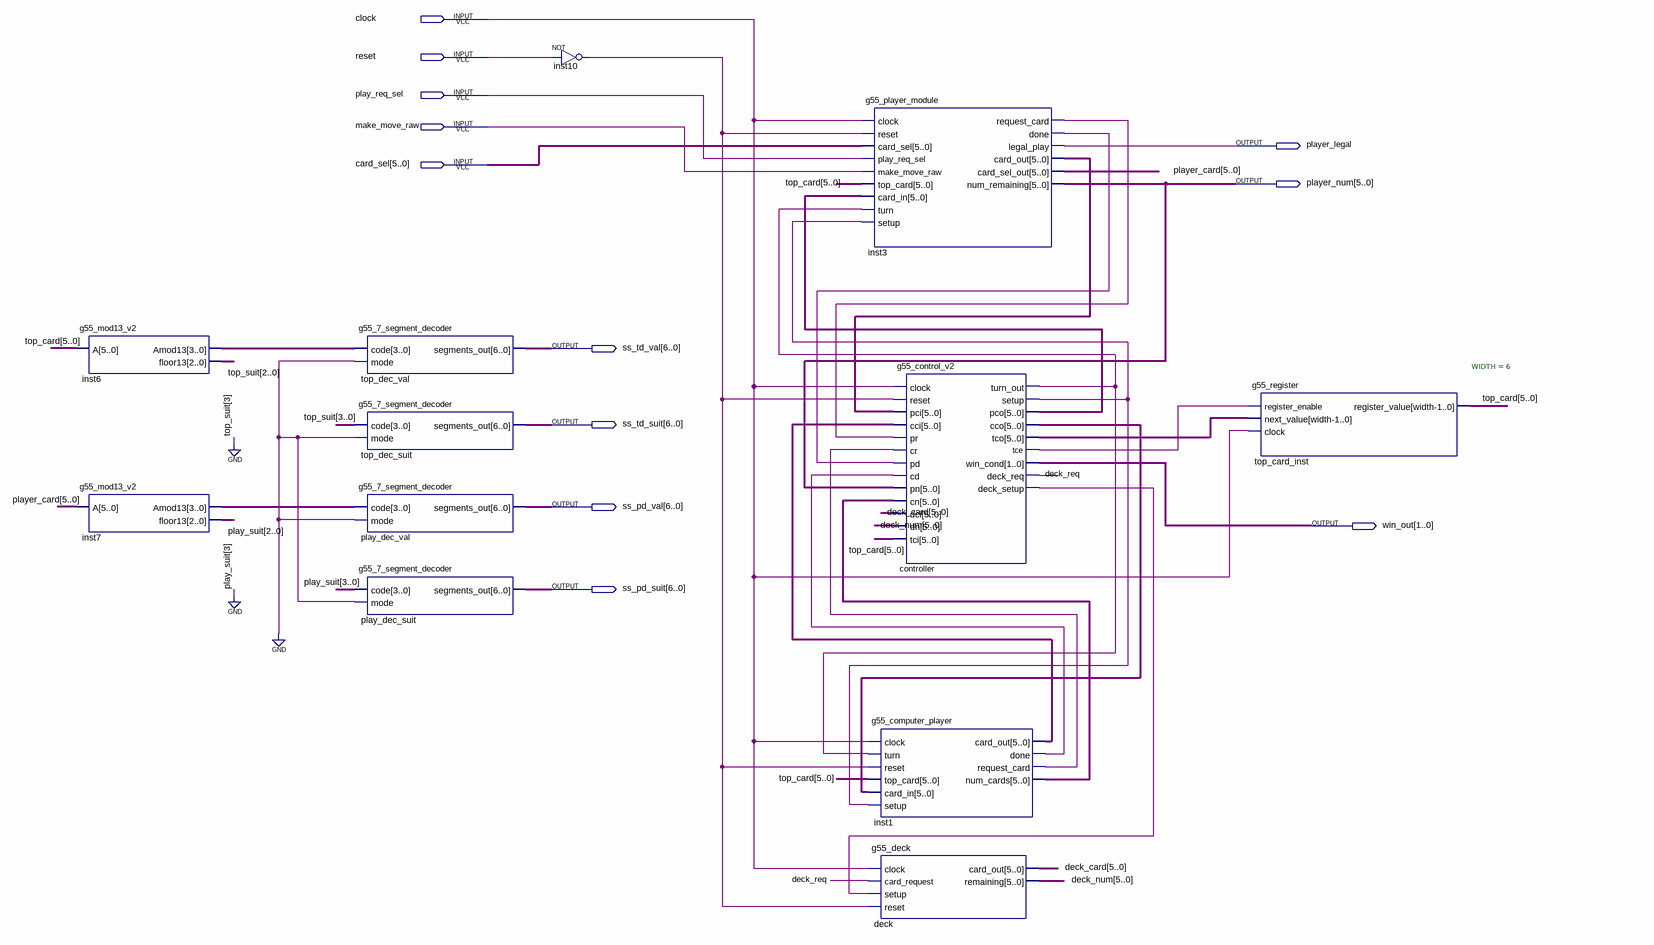
[diagram p0: schematic sheet]
// Quartus schematic g55_system_v2.bdf as structural Verilog: 12 symbols, 12 pins
module g55_system_v2 (
  input  clock,
  input  reset,
  input  play_req_sel,
  input  make_move_raw,
  input  [5:0] card_sel,
  output player_legal,
  output [5:0] player_num,
  output [6:0] ss_td_val,
  output [6:0] ss_td_suit,
  output [6:0] ss_pd_val,
  output [1:0] win_out,
  output [6:0] ss_pd_suit
);

  wire controller_deck_setup, controller_setup, controller_tce, controller_turn_out, deck_req, inst1_done,
       inst1_request_card, inst3_done, inst3_request_card, inst10_out;
  wire [2:0] play_suit, top_suit;
  wire [3:0] inst6_amod13, inst7_amod13;
  wire [5:0] controller_cco, controller_pco, controller_tco, deck_card, deck_num, inst1_card_out,
       inst1_num_cards, inst3_card_out, player_card, top_card;

  g55_mod13_v2 inst6 (.A(top_card), .Amod13(inst6_amod13), .floor13(top_suit));
  g55_mod13_v2 inst7 (.A(player_card), .Amod13(inst7_amod13), .floor13(play_suit));
  g55_7_segment_decoder top_dec_val (.code(inst6_amod13), .mode(1'b0), .segments_out(ss_td_val));
  g55_7_segment_decoder top_dec_suit (.code({1'b0, top_suit}), .mode(1'b0), .segments_out(ss_td_suit));
  g55_7_segment_decoder play_dec_val (.code(inst7_amod13), .mode(1'b0), .segments_out(ss_pd_val));
  g55_7_segment_decoder play_dec_suit (.code({1'b0, play_suit}), .mode(1'b0), .segments_out(ss_pd_suit));
  not inst10 (inst10_out, reset);
  g55_player_module inst3 (
    .clock(clock), .reset(inst10_out), .card_sel(card_sel), .play_req_sel(play_req_sel),
    .make_move_raw(make_move_raw), .top_card(top_card), .card_in(controller_pco), .turn(controller_turn_out),
    .setup(controller_setup), .request_card(inst3_request_card), .done(inst3_done),
    .legal_play(player_legal), .card_out(inst3_card_out), .card_sel_out(player_card),
    .num_remaining(player_num));
  g55_control_v2 controller (
    .clock(clock), .reset(inst10_out), .pci(inst3_card_out), .cci(inst1_card_out), .pr(inst3_request_card),
    .cr(inst1_request_card), .pd(inst3_done), .cd(inst1_done), .pn(player_num), .cn(inst1_num_cards),
    .dci(deck_card), .dn(deck_num), .tci(top_card), .turn_out(controller_turn_out), .setup(controller_setup),
    .pco(controller_pco), .cco(controller_cco), .tco(controller_tco), .tce(controller_tce),
    .win_cond(win_out), .deck_req(deck_req), .deck_setup(controller_deck_setup));
  g55_computer_player inst1 (
    .clock(clock), .turn(controller_turn_out), .reset(inst10_out), .top_card(top_card),
    .card_in(controller_cco), .setup(controller_setup), .card_out(inst1_card_out), .done(inst1_done),
    .request_card(inst1_request_card), .num_cards(inst1_num_cards));
  g55_deck deck (
    .clock(clock), .card_request(deck_req), .setup(controller_deck_setup), .reset(inst10_out),
    .card_out(deck_card), .remaining(deck_num));
  g55_register #(.WIDTH(6)) top_card_inst (
    .register_enable(controller_tce), .next_value(controller_tco), .clock(clock), .register_value(top_card));
endmodule
